# EAGLE schematic untitled (EAGLE 9.5.1)
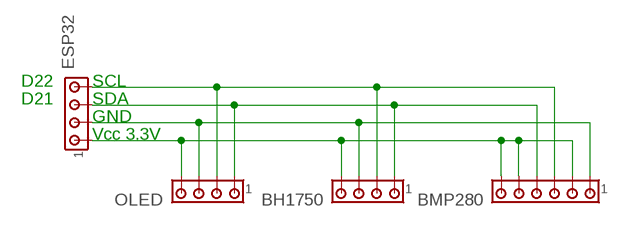
[diagram p0: schematic, sheet 1]

## Parts
BH1750  MTA04-100  [10X04MTA]
BMP280  MTA06-100  [10X06MTA]
ESP32  MTA04-100  [10X04MTA]
OLED  MTA04-100  [10X04MTA]

## Nets
N$1: BH1750.4 BMP280.2 BMP280.5 BMP280.6 ESP32.1 OLED.4
N$2: BH1750.3 BMP280.1 ESP32.2 OLED.3
N$3: BH1750.1 BMP280.4 ESP32.3 OLED.1
N$4: BH1750.2 BMP280.3 ESP32.4 OLED.2

## Notes on the sheet
- D22 | SCL
- D21 | SDA
- GND
- Vcc 3.3V

## Library data of the parts
BH1750 ESP32 OLED = con-amp:MTA04-100: AMP connector
BMP280 = con-amp:MTA06-100: AMP connector Connection corrected 2014-09-19